# Altium schematic sheet 3V-power.SchDoc
size A4
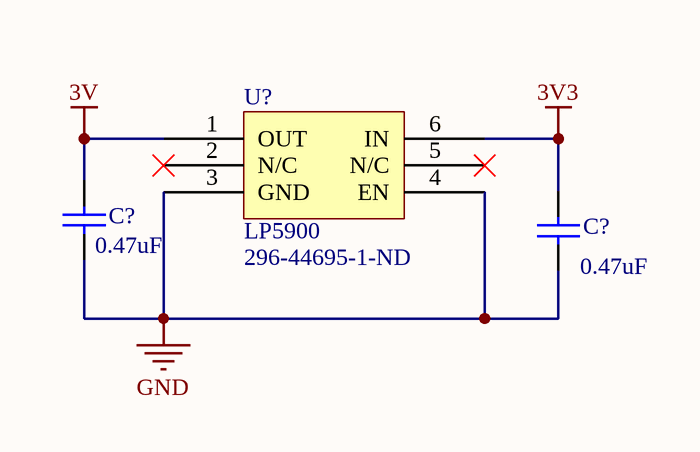
[diagram p0: 3V-power.SchDoc]

## Parts
(Parts that share a designator on the sheet are numbered #1, #2 ... from top to bottom, then left to right.)
C?#1  value 0.47uF  [C1206]  (hidden comment: Cap Semi)
C?#2  value 0.47uF  [C1206]  (hidden comment: Cap Semi)
U?  LP5900  Supplier Part Number 1: 296-44695-1-ND

## Nets
3V: C?#1.2 U?.1(OUT)
3V3: C?#2.2 U?.6(IN)
GND: C?#1.1 C?#2.1 U?.3(GND) U?.4(EN)

Not connected (* = marked no-connect by the designer): U? 2(N/C)* 5(N/C)*

## Library data of the parts
C?#1 C?#2 = Cap Semi: Capacitor (Semiconductor SIM Model); Published: 8-Jun-2000; LatestRevisionDate: 29-May-2009; LatestRevisionNote: IPC-7351 Footprint Added.; PackageReference: C1206; Publisher: Altium Limited; PackageDescription: Chip Capacitor
U? = LP5900: Low noise 3V low dropout regulator for analog and RF applications.; Supplier 1: Digi-Key